# EasyEDA Pro project STM32_SG90稳定平台.eprj

# Schematic STM32_SG90稳定平台

## Sheets
1 STM32F103C8T6: Create Date: 2023-10-22; Page Name: STM32F103C8T6; Project Name: STM32_SG90稳定平台; Schematic Name: 原理图; Update Date: 2023-10-22; Add into BOM: yes; Company: 嘉立创EDA; Convert to PCB: yes; Page Size: A4; Version: V1.0
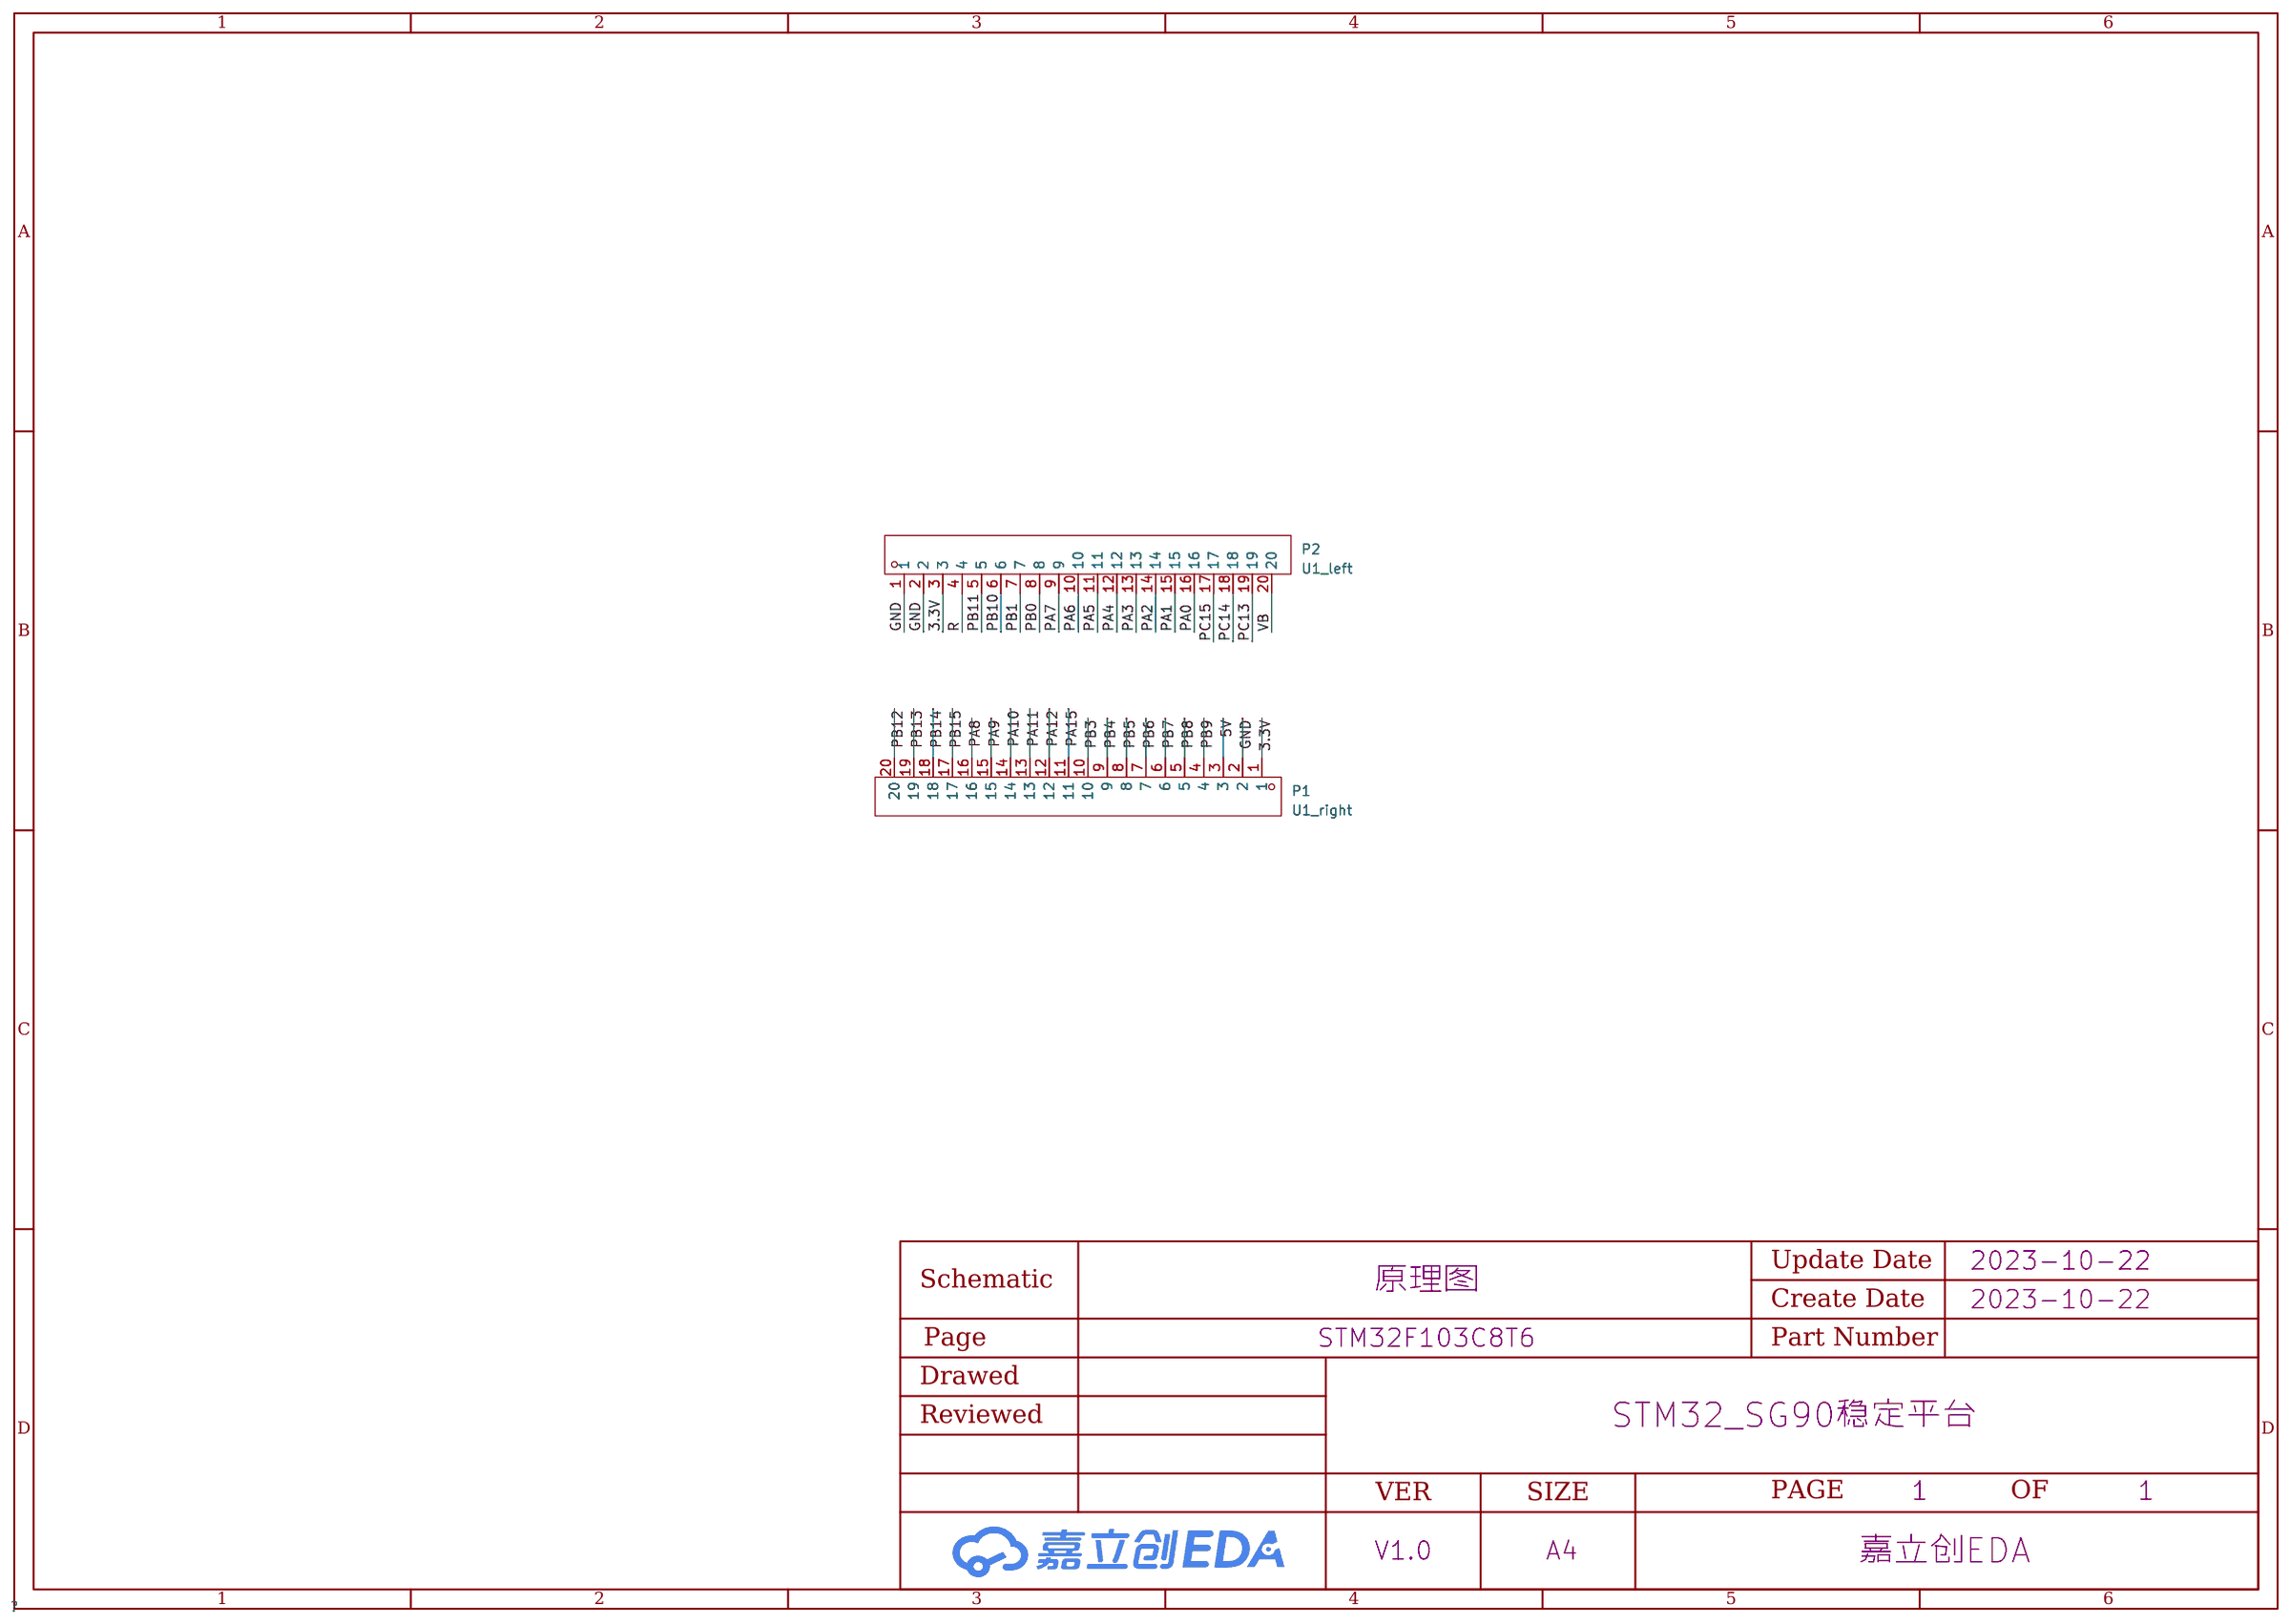
[diagram p0: STM32F103C8T6]
2 MPU6050: Page Name: MPU6050; Schematic Name: STM32_SG90稳定平台
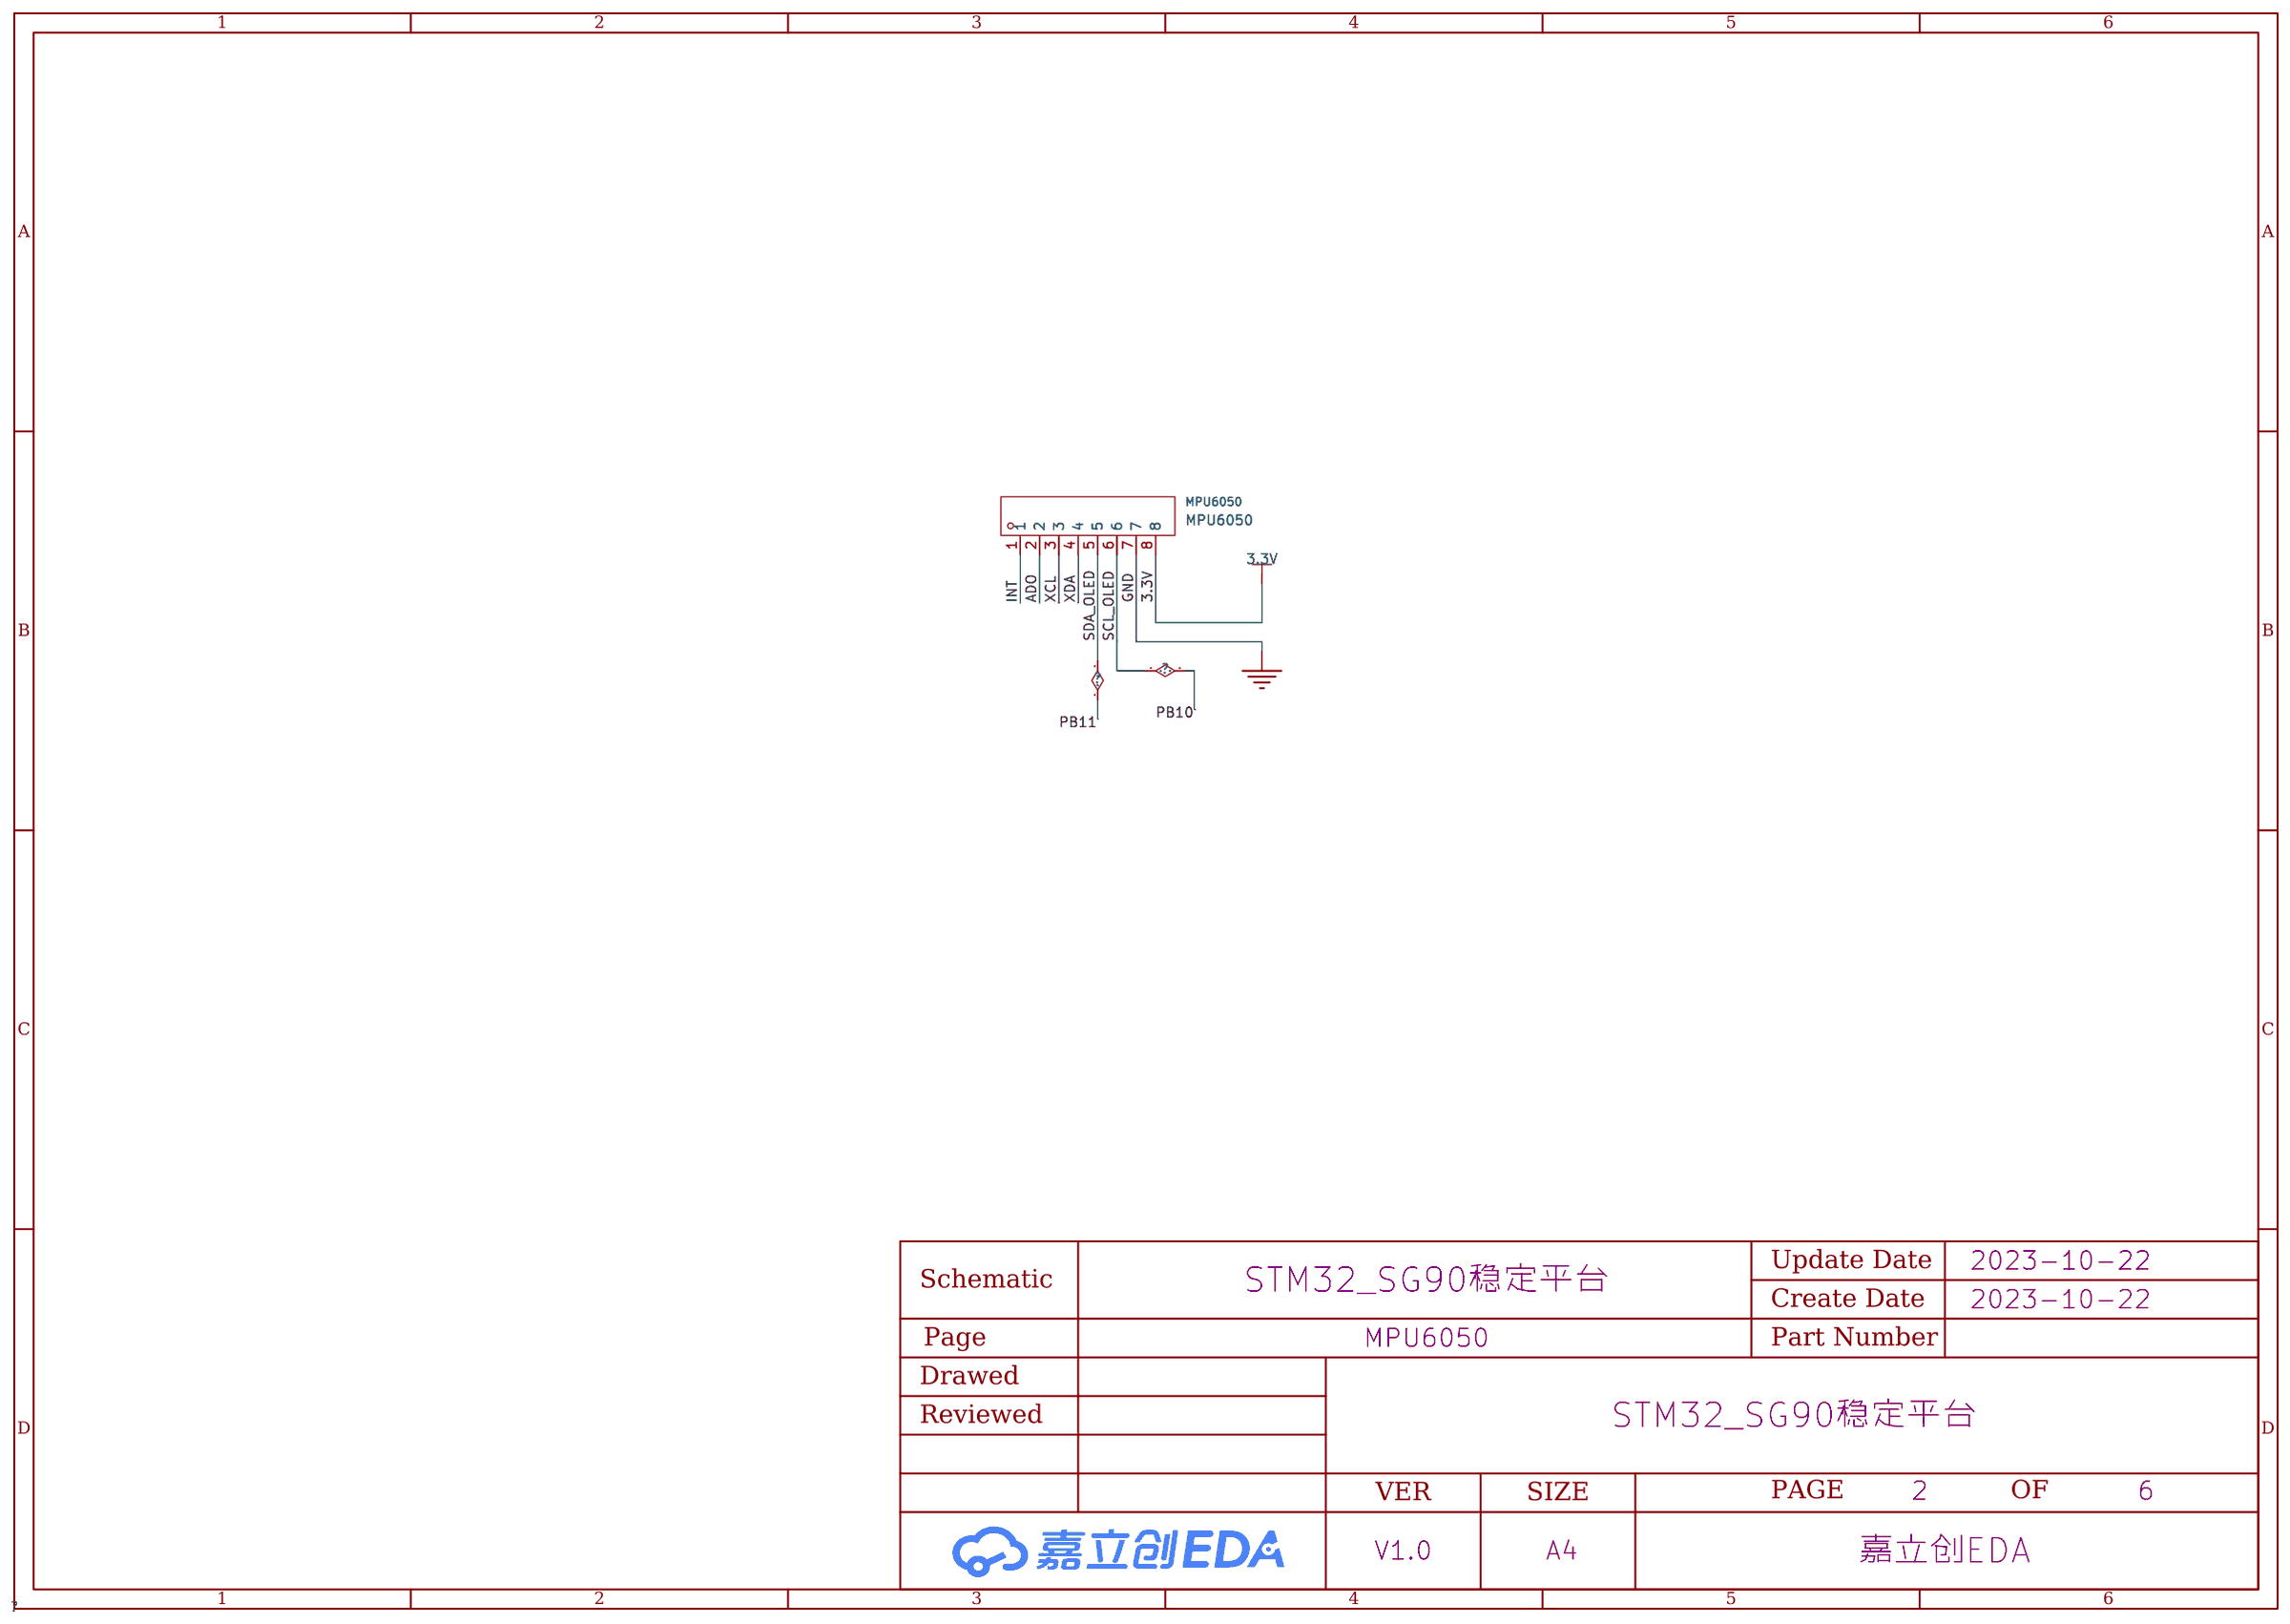
[diagram p1: MPU6050]
3 电源: Page Name: 电源; Schematic Name: STM32_SG90稳定平台
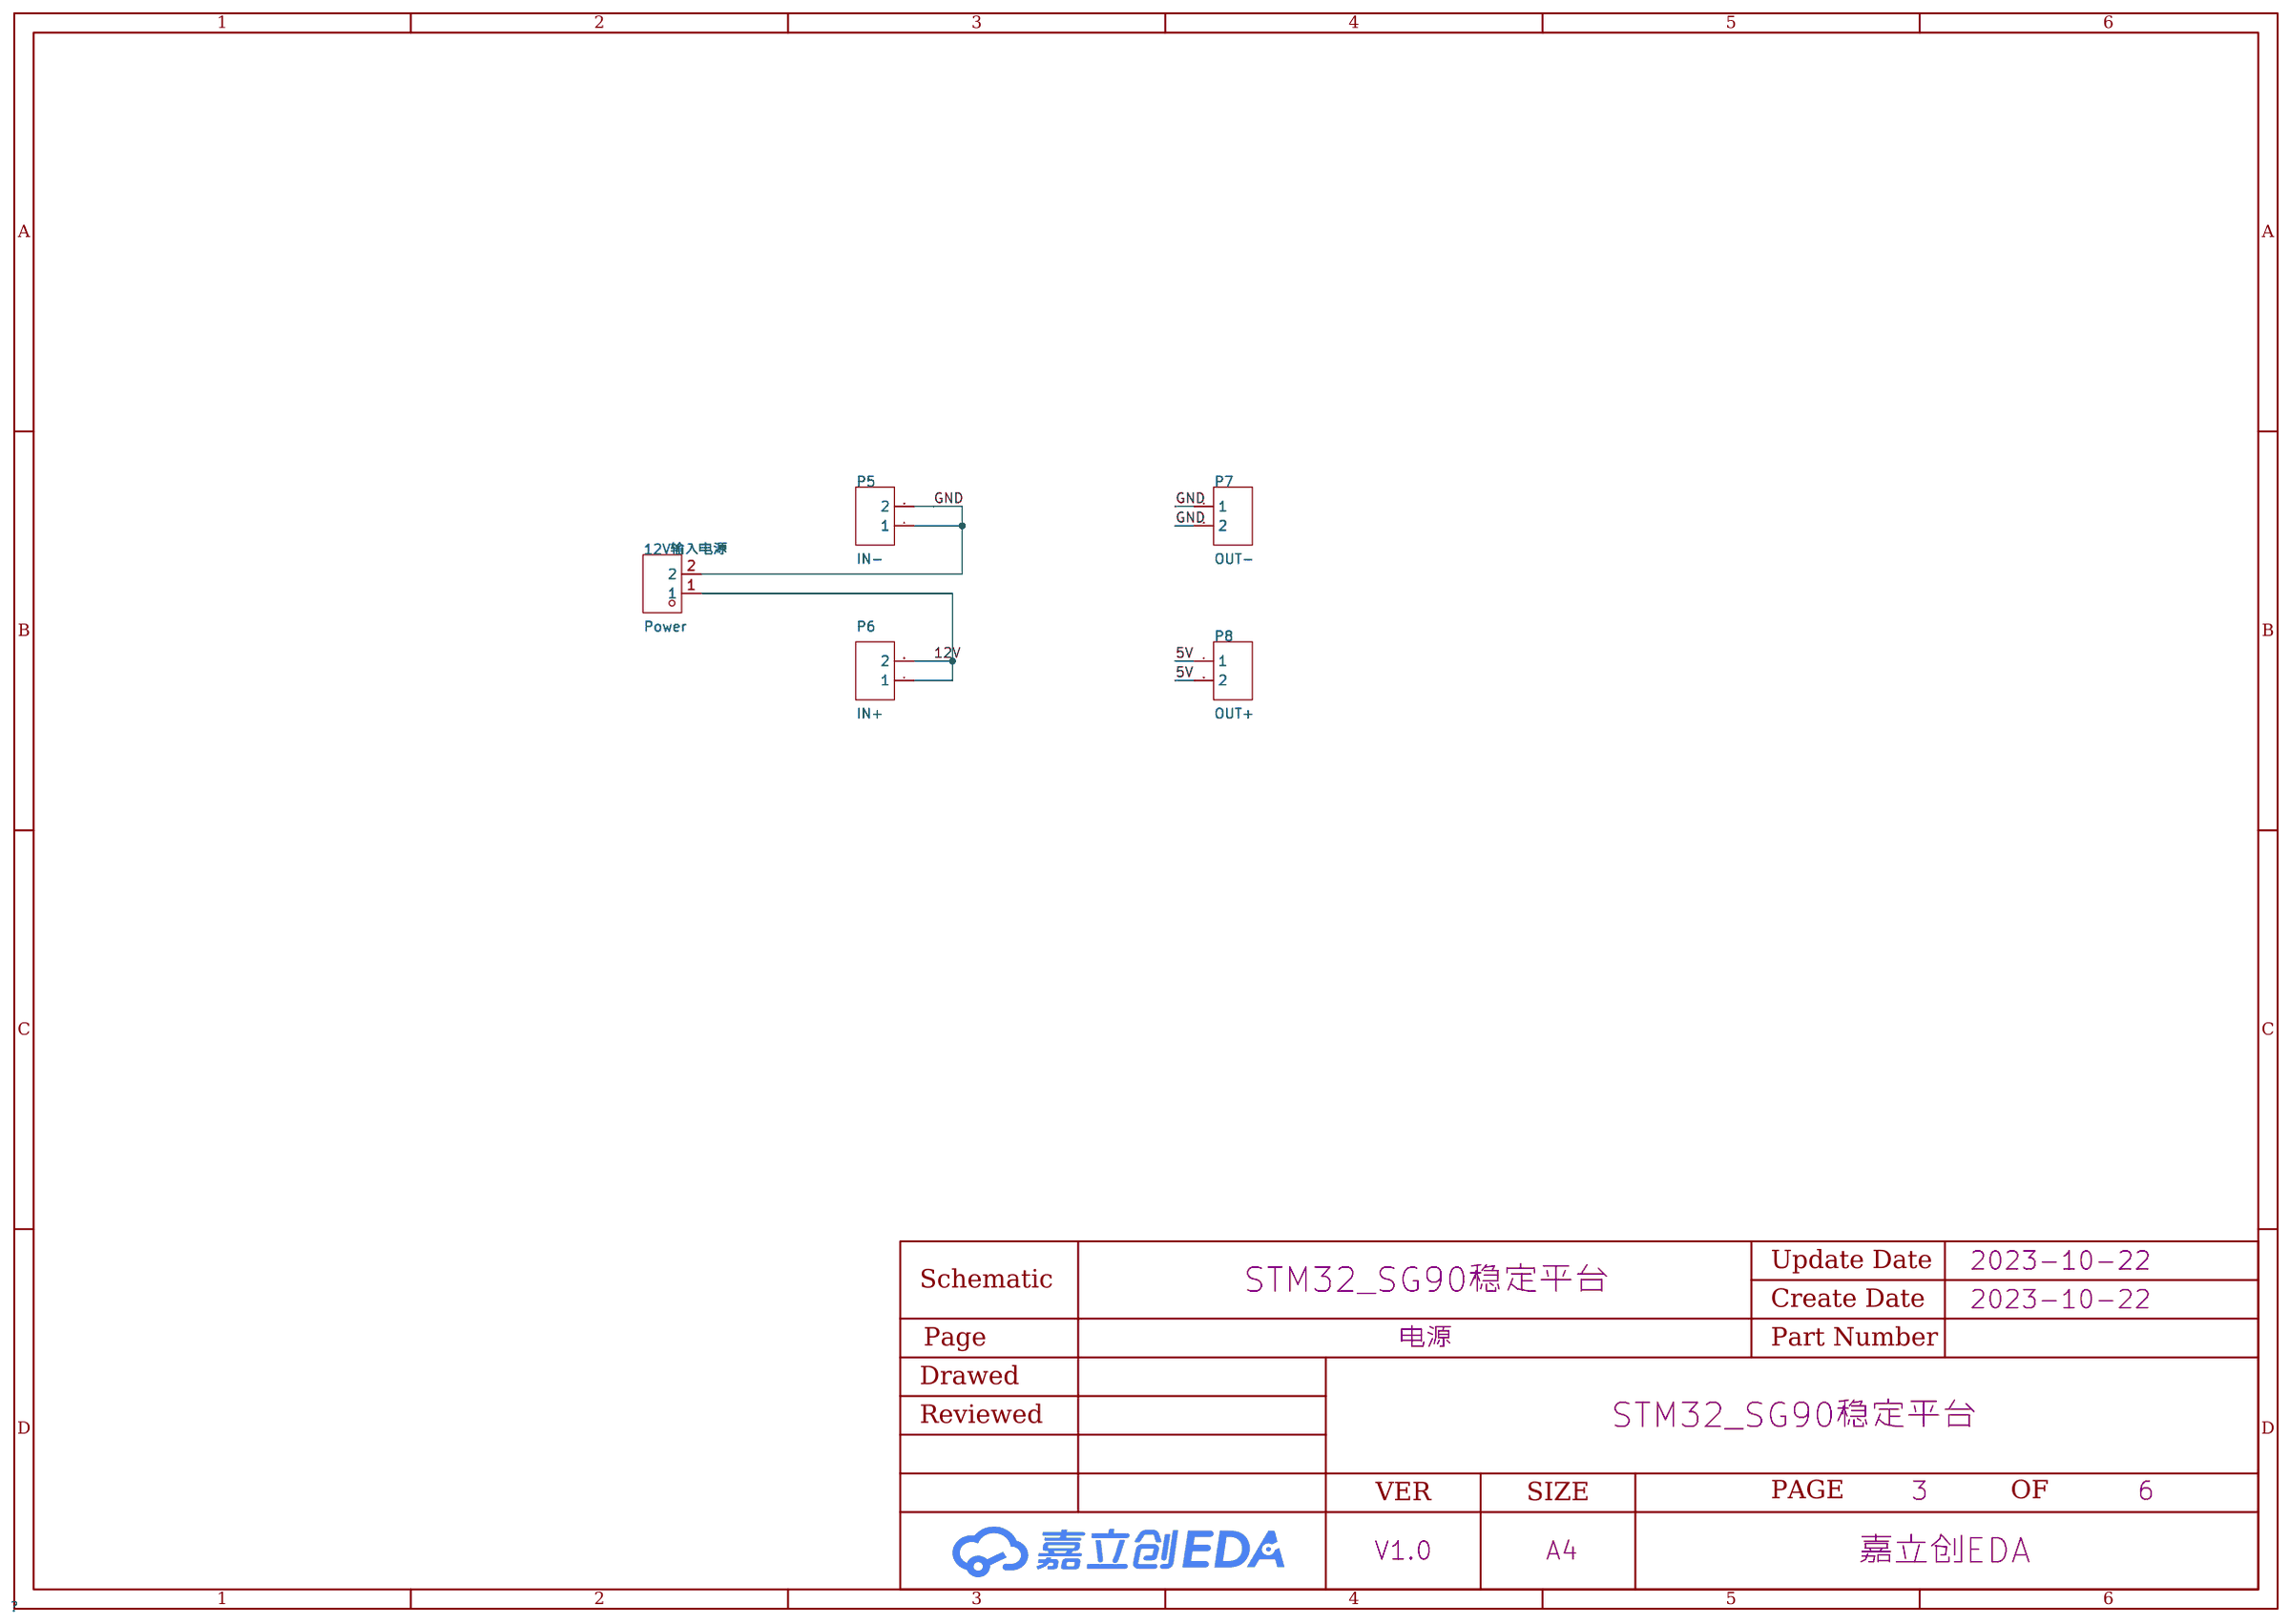
[diagram p2: 电源]
4 OLED: Page Name: OLED; Schematic Name: STM32_SG90稳定平台; Update Date: 2023-10-23
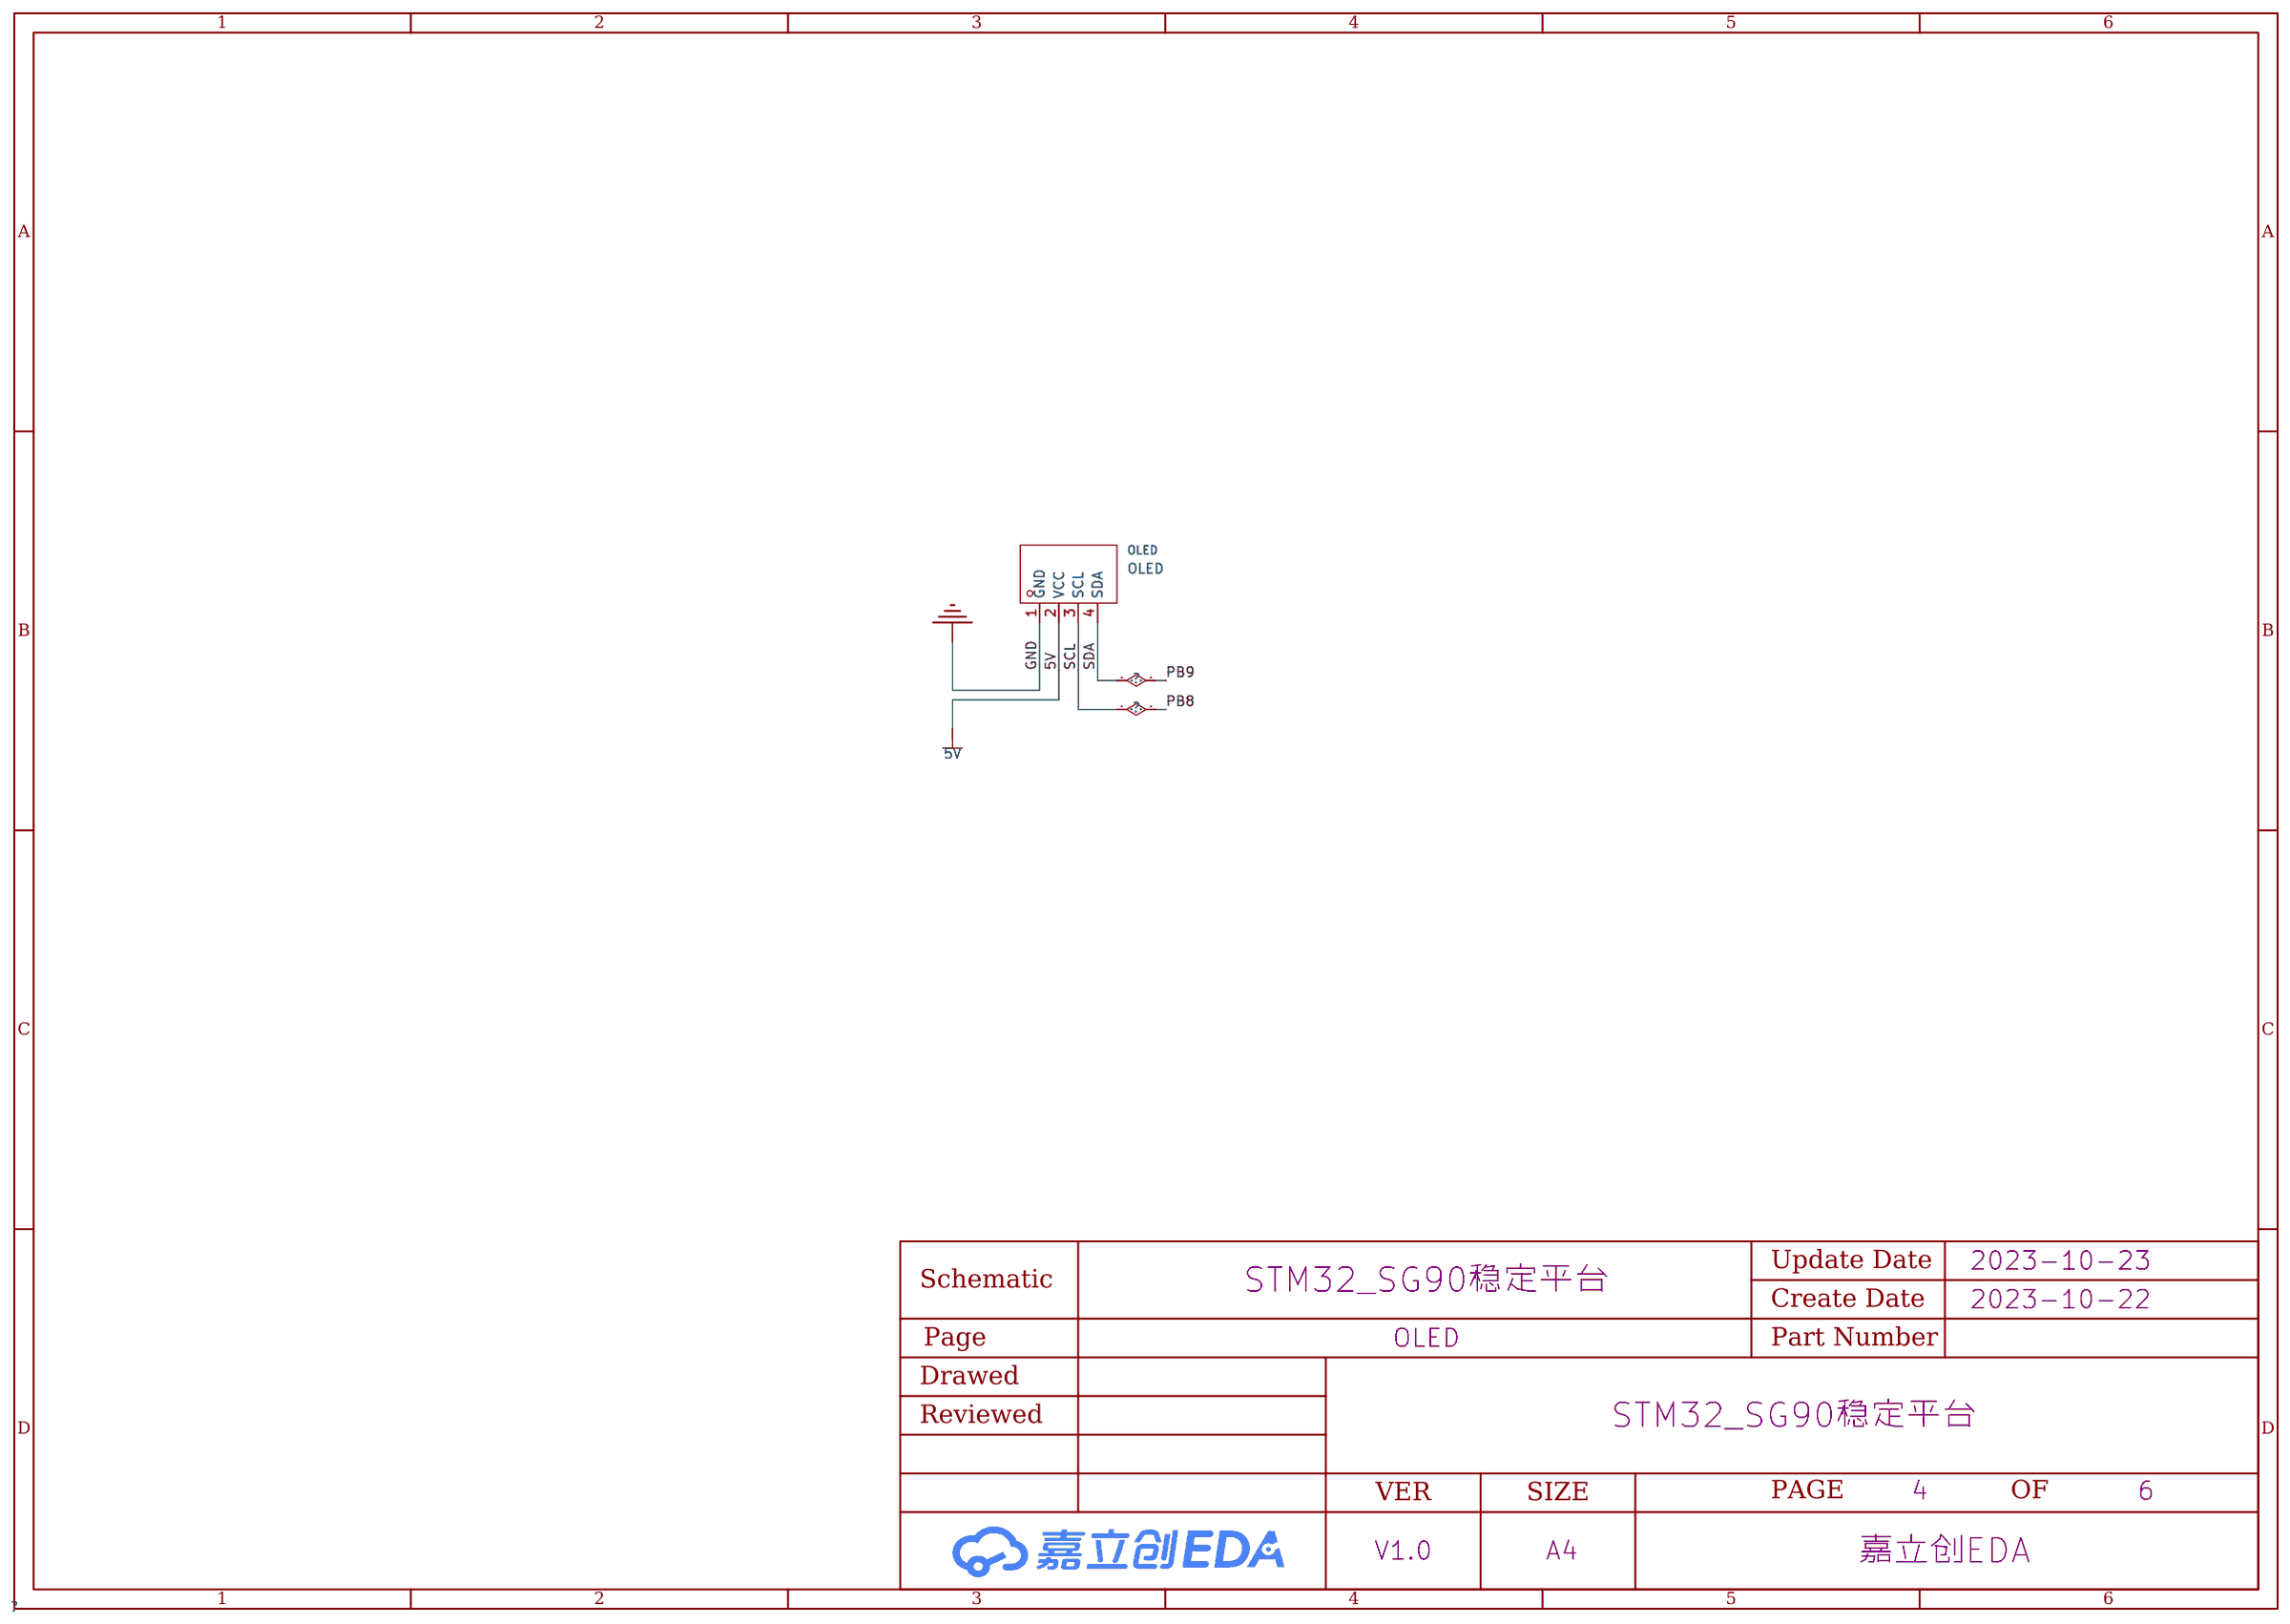
[diagram p3: OLED]
5 SG90舵机: Create Date: 2023-10-23; Page Name: SG90舵机; Schematic Name: STM32_SG90稳定平台; Update Date: 2023-10-23
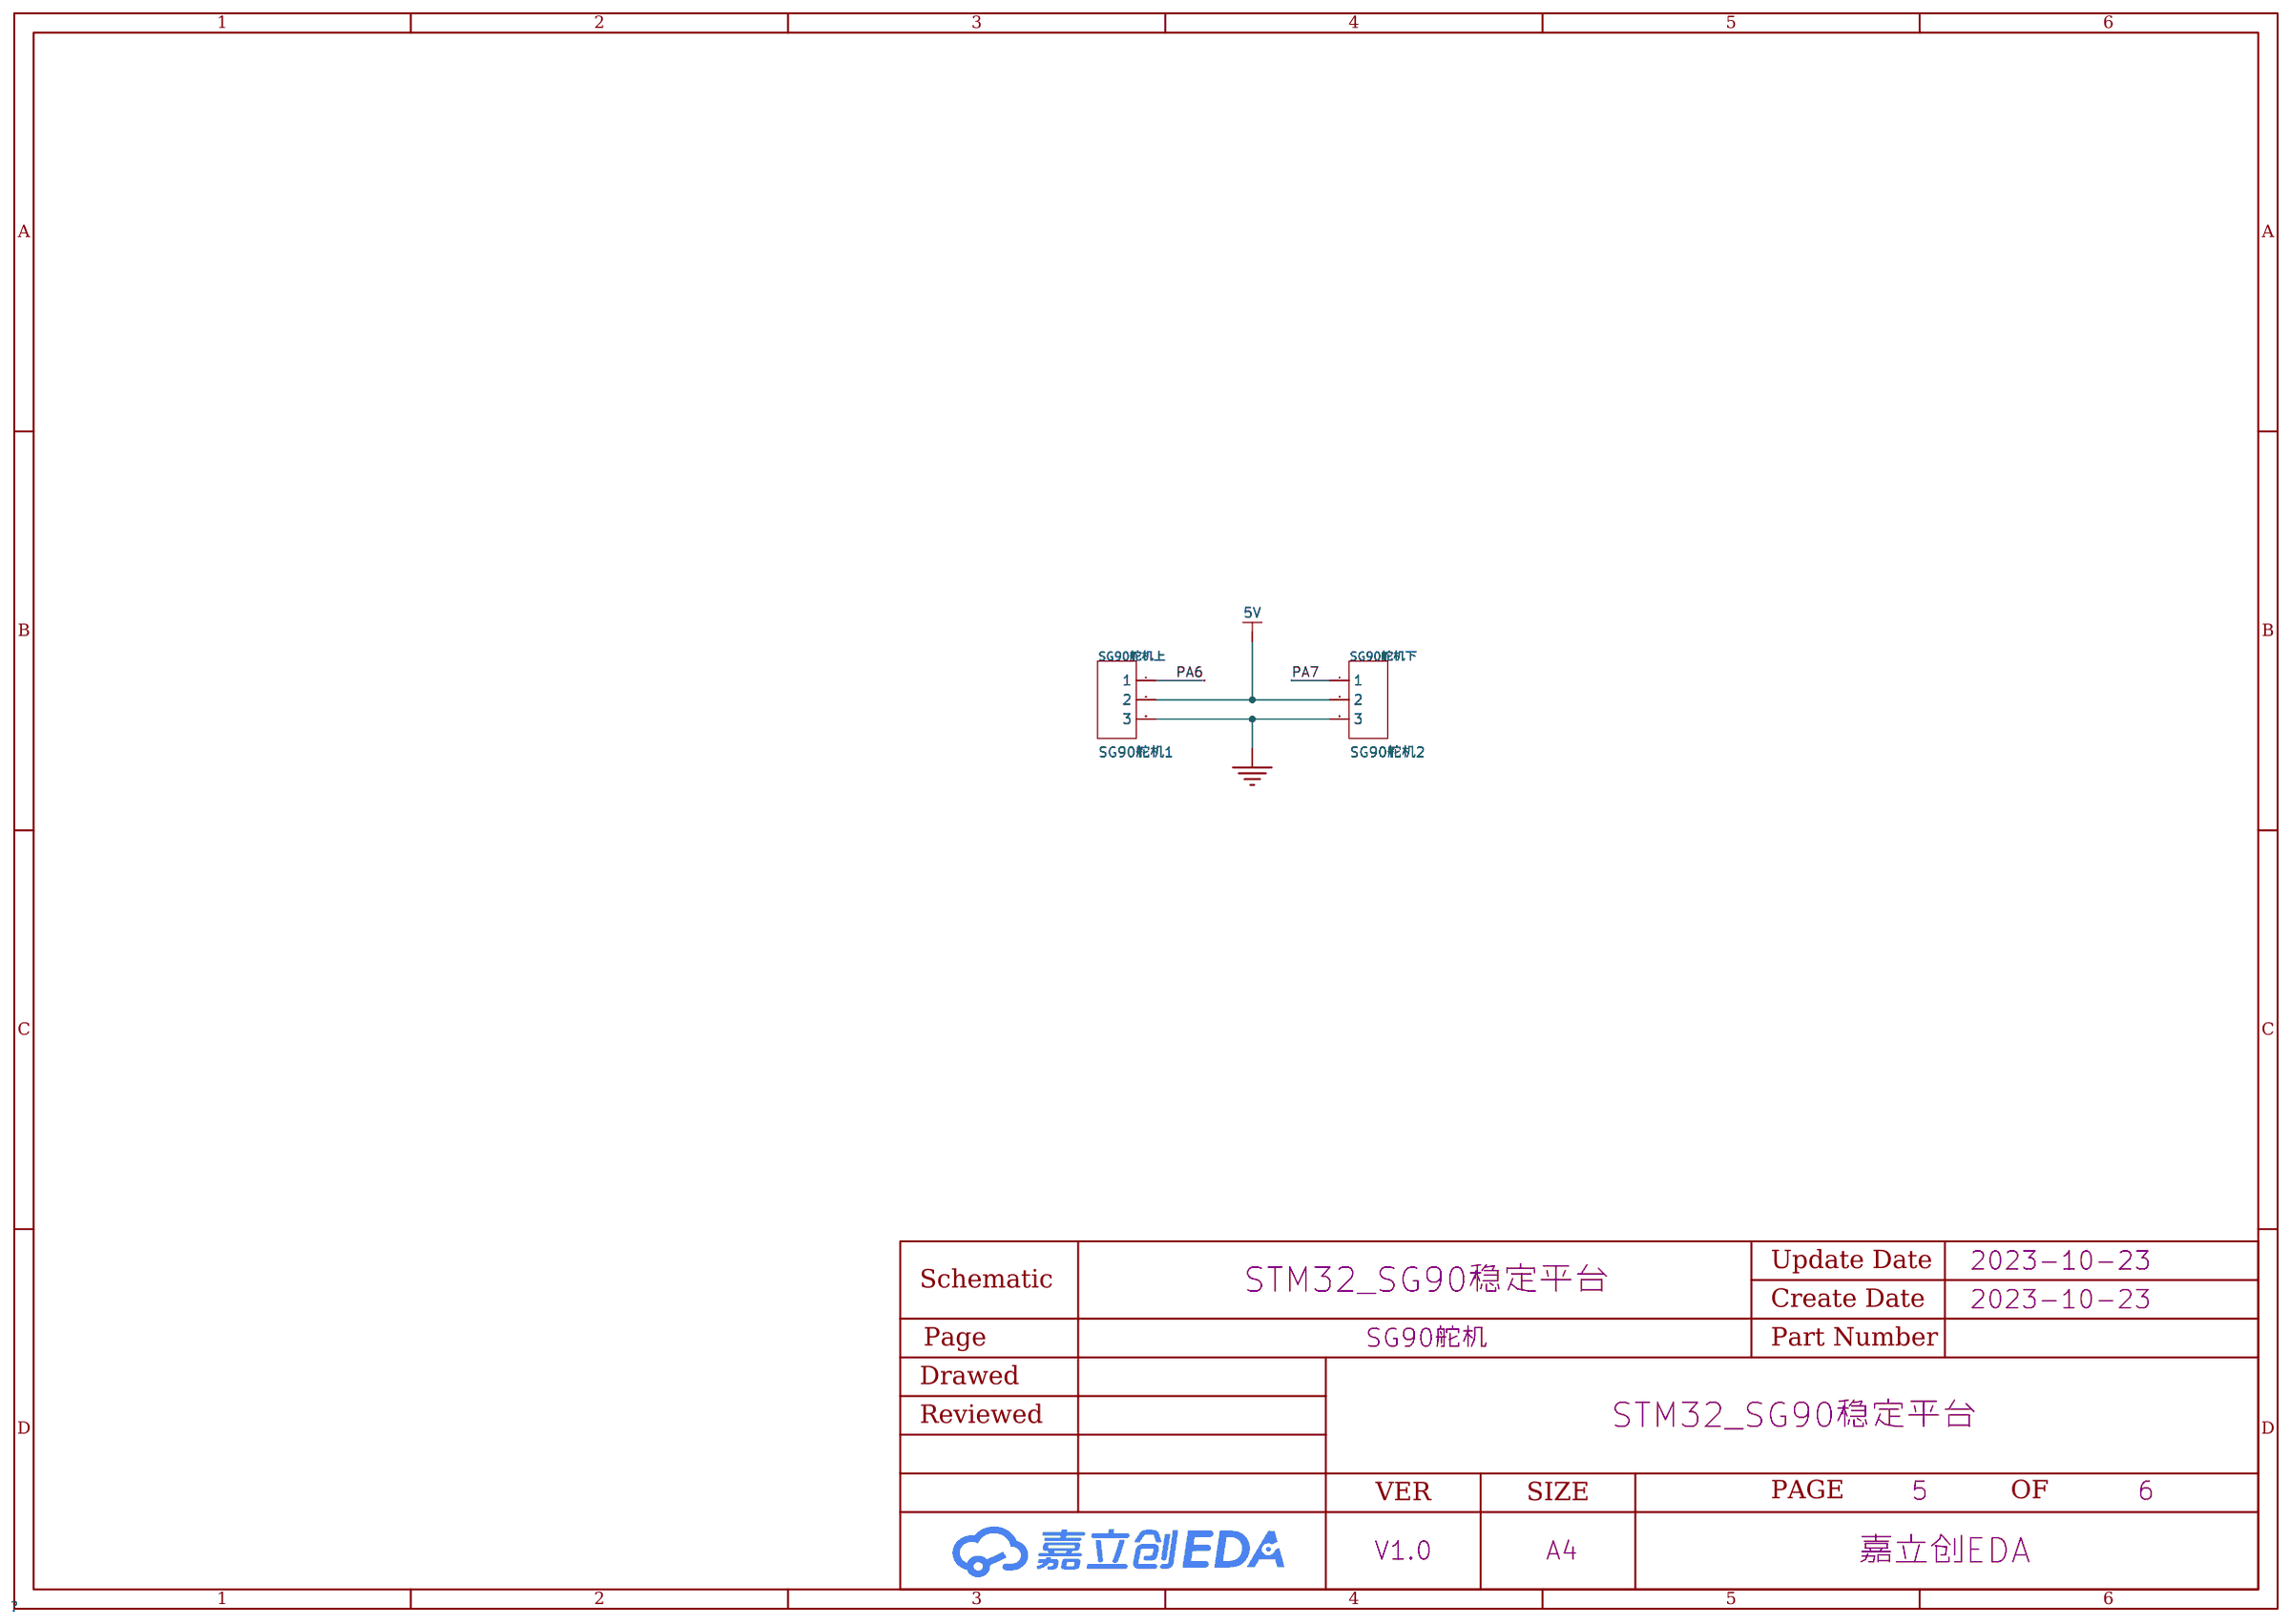
[diagram p4: SG90舵机]
6 串口: Create Date: 2023-10-23; Page Name: 串口; Schematic Name: STM32_SG90稳定平台; Update Date: 2023-10-23
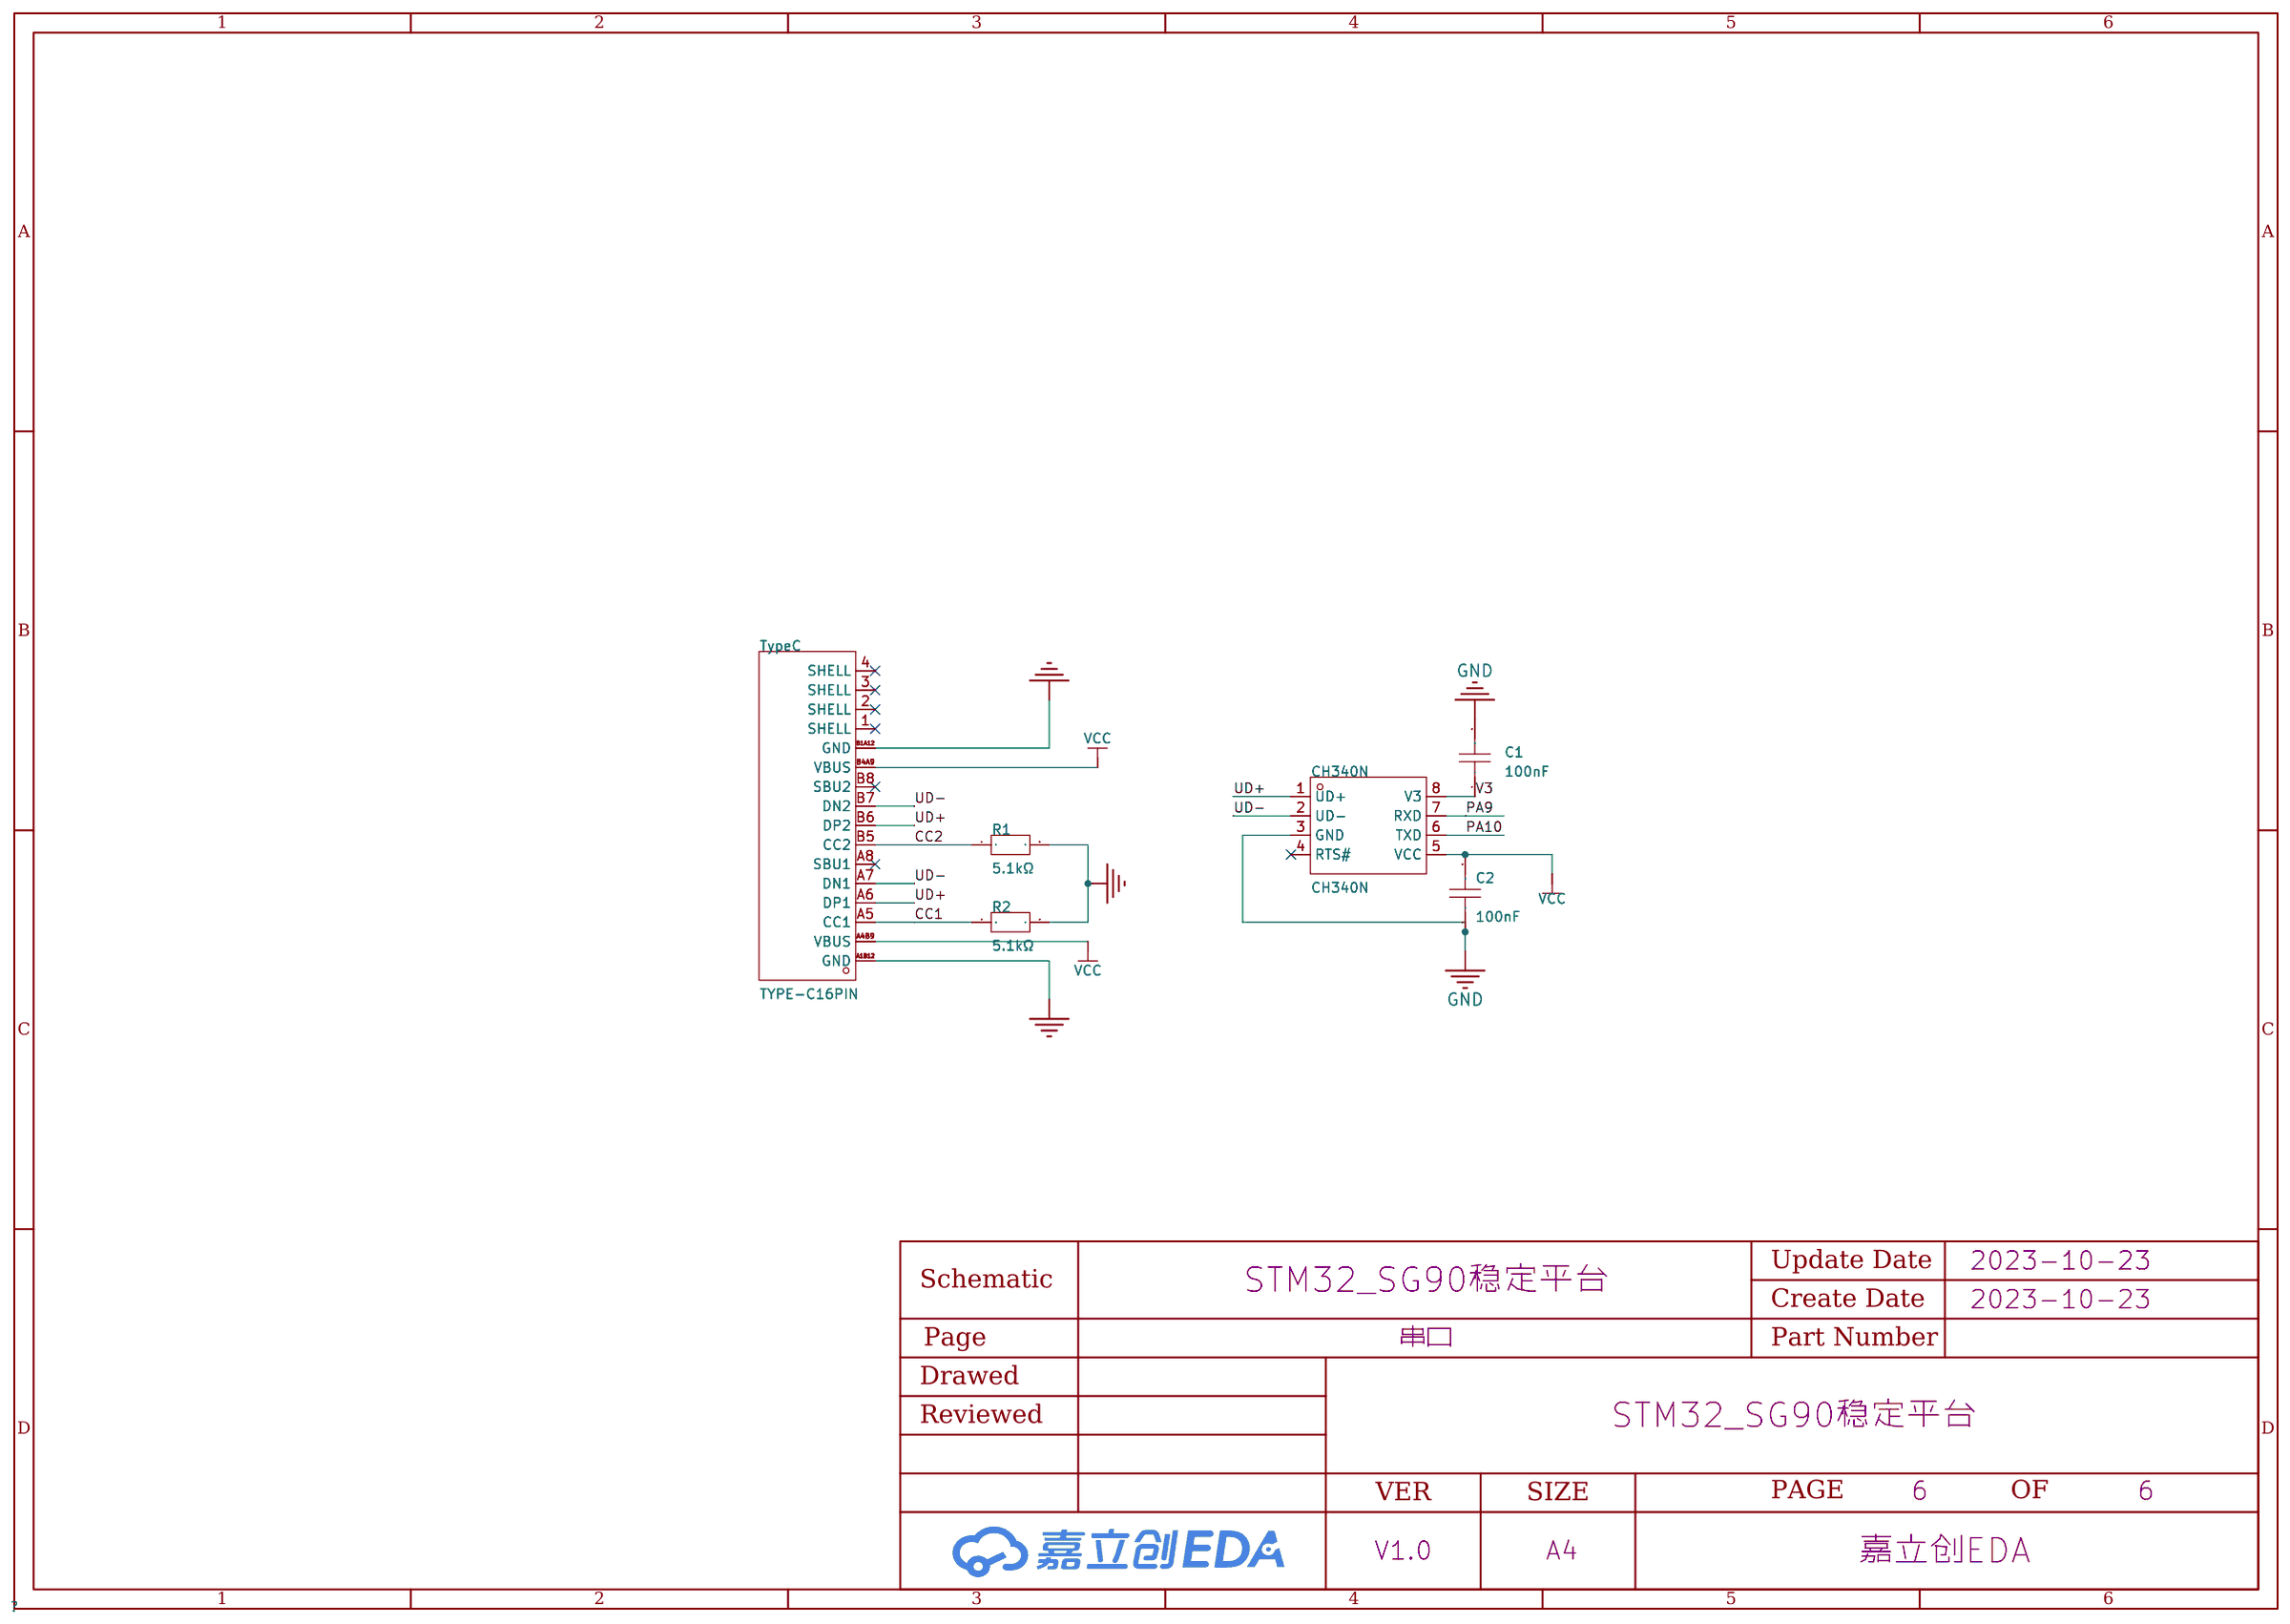
[diagram p5: 串口]

## Parts
sheet MPU6050
MPU6050  MPU6050  [HDR-TH_8P-P2.54-V-F]
sheet OLED
OLED  OLED  [OLED-TH_L27.8-W27.2-P2.54_C9900033791]
sheet SG90舵机
SG90舵机上  SG90舵机1  [HDR-TH_3P-P2.54-V-M-1]
SG90舵机下  SG90舵机2  [HDR-TH_3P-P2.54-V-M-1]
sheet STM32F103C8T6
P1  U1_right  [HDR-TH_20P-P2.54-V-F]
P2  U1_left  [HDR-TH_20P-P2.54-V-F]
sheet 串口
C1  100nF  [CAP-TH_L8.5-W5.0-P5.00-D1.2]
C2  100nF  [CAP-TH_L8.5-W5.0-P5.00-D1.2]
CH340N  CH340N  [SOP-8_L4.9-W3.9-P1.27-LS6.0-BL]
R1  5.1kΩ  [RES-TH_BD2.7-L6.2-P10.20-D0.4]
R2  5.1kΩ  [RES-TH_BD2.7-L6.2-P10.20-D0.4]
TypeC  TYPE-C16PIN  [USB-C-SMD_TYPE-C16PIN]
sheet 电源
12V输入电源  Power  [CONN-TH_KF7.62-2P]
P5  IN-  [HDR-TH_2P-P2.54-V-F]
P6  IN+  [HDR-TH_2P-P2.54-V-F]
P7  OUT-  [HDR-TH_2P-P2.54-V-F]
P8  OUT+  [HDR-TH_2P-P2.54-V-F]

## Library data of the parts
MPU6050 = ZX-PM2.54-1-8PY: 排数:单排;总孔位数:8P;间距:2.54mm;插孔结构:1x8P;行距:-;安装类型:直插;圆孔/方孔:方孔;额定电流:3A;额定电压:1kV;插孔方向:顶部;塑高:8.5mm;触头材质:青铜;触头镀层:金;工作温度范围:-40℃~+105℃;焊接温度(最大值):260℃@5S;; LCSC Part Name: 间距:2.54mm 1x8P 直插; Supplier Part: C7499328; Manufacturer: Megastar(兆星); Supplier Footprint: 插件,P=2.54mm; Datasheet: https://atta.szlcsc.com/upload/public/pdf/source/20230804/D626B3CF681C0E68EA183C516E9CB982.pdf; Supplier: LCSC; Number of Rows: 单排; Number of Holes: 8P; Pitch: 2.54mm; Holes Structure: 1x8P; Mounting Type: 直插; Circular Hole / Square Hole: 方孔; Current Rating (Max): 3A; Voltage Rating (Max): 1kV; Holes Direction: 顶部; Insulation Height: 8.5mm; Contact Material: 青铜; Contact Plating: 金; Operating Temperature Range: -40℃~+105℃; Welding Temperature (Max): 260℃@5S
OLED = HS96L03W2C03: 尺寸(inch)：0.96寸 0.96' 像素分辨率：128x64 128*64主控芯片：SSD1315 接口类型：I2C 外形:27.3*27.8；IIC/3SPI/4SPI串口通讯,工作温度范围-40℃—+70℃。4PIN黑底白光。; LCSC Part Name: 0.96寸OLED显示屏窄白光IIC; Supplier Part: C5248080; Manufacturer: HS(汉昇); JLCPCB Part Class: Extended Part; Datasheet: https://atta.szlcsc.com/upload/public/pdf/source/20230627/763D01F79A90007632F098068C7C8AD9.pdf; Supplier: LCSC
SG90舵机上 SG90舵机下 = 2.54-1*3P针: 排数:单排;总PIN位数:3;间距:2.54mm;插针结构:1x3P;行距:-;安装类型:直插;圆针/方针:方针;额定电流:3A;额定电压:-;配合针长度:-;塑高:-;端接针长度:-;触头材质:-;触头镀层:-;工作温度范围:-40℃~+105℃;颜色:黑色;; LCSC Part Name: 2.54mm 1x3P 直插 方针; Supplier Part: C49257; Manufacturer: BOOMELE(博穆精密); Supplier Footprint: 直插,P=2.54mm; JLCPCB Part Class: 扩展库; Supplier: LCSC; Number of Rows: 单排; Number of Pins: 3; Pitch: 2.54mm; Pin Structure: 1x3P; Mounting Type: 直插; Circluar Pins/Square Pins: 方针; Current Rating (Max): 3A; Operating Temperature Range: -40℃~+105℃; Color: 黑色
P1 P2 = 22850120ANG1SYA01: 排数:单排;总孔位数:20P;间距:2.54mm;插孔结构:1x20P;行距:-;安装类型:直插;塑高:-;触头材质:黄铜;触头镀层:-;; LCSC Part Name: 间距:2.54mm 1x20P 直插; Supplier Part: C429947; Manufacturer: JILN(锦凌); Supplier Footprint: 插件,P=2.54mm; JLCPCB Part Class: 扩展库; Datasheet: https://atta.szlcsc.com/upload/public/pdf/source/20190920/C429966_F6288D72CB1EF194DAF75E8AC5D57877.pdf; Supplier: LCSC; Number of Rows: 单排; Number of Holes: 20P; Pitch: 2.54mm; Holes Structure: 1x20P; Mounting Type: 直插; Contact Material: 黄铜
C1 C2 = CT4-0805B104K500F3: 容值:100nF;精度:±10%;额定电压:50V;温度系数:X7R;; LCSC Part Name: 100nF ±10% 50V; Supplier Part: C84772; Manufacturer: FH(风华); Supplier Footprint: 插件,P=5.08mm; JLCPCB Part Class: 扩展库; Datasheet: https://atta.szlcsc.com/upload/public/pdf/source/20161024/1477288669695.pdf; Supplier: LCSC; Tolerance: ±10%; Voltage Rated: 50V; Temperature Coefficient: X7R
CH340N = CH340N: Supplier Part: C2977777; Manufacturer: WCH(南京沁恒); Supplier Footprint: SOP-8; JLCPCB Part Class: Extended Part; Datasheet: https://atta.szlcsc.com/upload/public/pdf/source/20220223/82A45E4FF89B3EDCAD50B354450A7EF4.pdf; Supplier: LCSC
R1 R2 = CR1/4W-5K1±5%-ST26: 电阻类型:碳膜电阻;阻值:5.1kΩ;精度:±5%;功率:250mW;; LCSC Part Name: 碳膜电阻 5.1kΩ ±5% 250mW; Supplier Part: C2896864; Manufacturer: VO(翔胜); Supplier Footprint: 插件,2.7x6.2mm; JLCPCB Part Class: 扩展库; Datasheet: https://atta.szlcsc.com/upload/public/pdf/source/20210803/C2857407_45FF53FE186CAB545115AD37303966CD.pdf; Supplier: LCSC; Type: 碳膜电阻; Tolerance: ±5%; Power(Watts): 250mW; Temperature Coefficient: ±350ppm/℃; Overload Voltage (Max): 250V; Operating Temperature Range: -55℃~+155℃
TypeC = TYPE-C16PIN: 连接器类型:Type-C;标准:-;公母:母座;触点数量:16;端口数量:1;安装方式:卧贴;额定电流 - 电源:3A;工作温度范围:-40℃~+85℃;; LCSC Part Name: Type-C 母座 卧贴 快充闪充 停产; Supplier Part: C393939; Manufacturer: SHOU HAN(首韩); Supplier Footprint: SMD; JLCPCB Part Class: Extended Part; Datasheet: https://atta.szlcsc.com/upload/public/pdf/source/20190521/C393939_7B9043D4CF1026AF443AB60D91FBCD5C.pdf; Supplier: LCSC; Connector Type: Type-C; Gender: 母座; Number of Contacts: 16; Number of Ports: 1; Mounting Style: 卧贴; Current Rating - Power (Max): 3A; Operating Temperature Range: -40℃~+85℃
12V输入电源 = KF7.62-2P: 隔板类型:两面;间距:7.62mm;每排PIN数:2;排数:1;安装方式:直针;引脚位置:边脚;额定电流:24A;额定电压:450V;线规 - AWG:12~22;线规 - mm?:2.5;工作温度范围:-40℃~+105℃;颜色:黑色;; LCSC Part Name: 7.62mm 每排P数:2 排数:1 直针 边脚 黑色; Supplier Part: C707824; Manufacturer: KEFA(科发); Supplier Footprint: 直插,P=7.62mm; JLCPCB Part Class: 扩展库; Datasheet: https://atta.szlcsc.com/upload/public/pdf/source/20200911/C707824_085D20F539EB43FE255F4A82729CD447.pdf; Supplier: LCSC; Barrier Type: 两面; Pitch: 7.62mm; Number of PINs Per Row: 2; Number of Rows: 1; Mounting Style: 直针; Pin Location: 边脚; Current Rating (Max): 24A; Voltage Rating (Max): 450V; Wire Gauge - AWG: 12~22; Wire Gauge - mm?: 2.5; Operating Temperature Range: -40℃~+105℃; Color: 黑色
P5-P8 = 2.54-1*2P母: 排数:单排;总孔位数:2P;间距:2.54mm;插孔结构:1x2P;行距:-;安装类型:直插;塑高:-;触头材质:-;触头镀层:-;; LCSC Part Name: 间距:2.54mm 1x2P 直插; Supplier Part: C49661; Manufacturer: BOOMELE(博穆精密); Supplier Footprint: 插件,P=2.54mm; JLCPCB Part Class: 扩展库; Datasheet: https://atta.szlcsc.com/upload/public/pdf/source/20210301/C2718488_F4427B881E42CAA8DDB0B1C12B3A522C.pdf; Supplier: LCSC; Number of Rows: 单排; Number of Holes: 2P; Pitch: 2.54mm; Holes Structure: 1x2P; Mounting Type: 直插

## Nets
3.3V: MPU6050.8 P1.1 P2.3
5V: OLED.2(VCC) P1.3 P8.1 P8.2 SG90舵机上.2 SG90舵机下.2
12V: 12V输入电源.1 P6.1 P6.2
GND: 12V输入电源.2 C1.2 C2.1 CH340N.3(GND) MPU6050.7 OLED.1(GND) P1.2 P2.1 P2.2 P5.1 P5.2 P7.1 P7.2 R1.2 R2.2 SG90舵机上.3 SG90舵机下.3 TypeC.A1B12(GND) TypeC.B1A12(GND)
V3: C1.1 CH340N.8(V3)
VCC: C2.2 CH340N.5(VCC) TypeC.A4B9(VBUS) TypeC.B4A9(VBUS)
ADO: MPU6050.2
CC1: R2.1 TypeC.A5(CC1)
CC2: R1.1 TypeC.B5(CC2)
INT: MPU6050.1
PA0: P2.16
PA1: P2.15
PA2: P2.14
PA3: P2.13
PA4: P2.12
PA5: P2.11
PA6: P2.10 SG90舵机上.1
PA7: P2.9 SG90舵机下.1
PA8: P1.16
PA9: CH340N.7(RXD) P1.15
PA10: CH340N.6(TXD) P1.14
PA11: P1.13
PA12: P1.12
PA15: P1.11
PB0: P2.8
PB1: P2.7
PB3: P1.10
PB4: P1.9
PB5: P1.8
PB6: P1.7
PB7: P1.6
PB8: OLED.3(SCL) P1.5
PB9: OLED.4(SDA) P1.4
PB10: MPU6050.6 P2.6
PB11: MPU6050.5 P2.5
PB12: P1.20
PB13: P1.19
PB14: P1.18
PB15: P1.17
PC13: P2.19
PC14: P2.18
PC15: P2.17
R: P2.4
UD+: CH340N.1(UD+) TypeC.A6(DP1) TypeC.B6(DP2)
UD-: CH340N.2(UD-) TypeC.A7(DN1) TypeC.B7(DN2)
VB: P2.20
XCL: MPU6050.3
XDA: MPU6050.4

Not connected (* = marked no-connect by the designer): CH340N 4(RTS#)*; TypeC 1(SHELL)* 2(SHELL)* 3(SHELL)* 4(SHELL)* A8(SBU1)* B8(SBU2)*

# Board PCB1
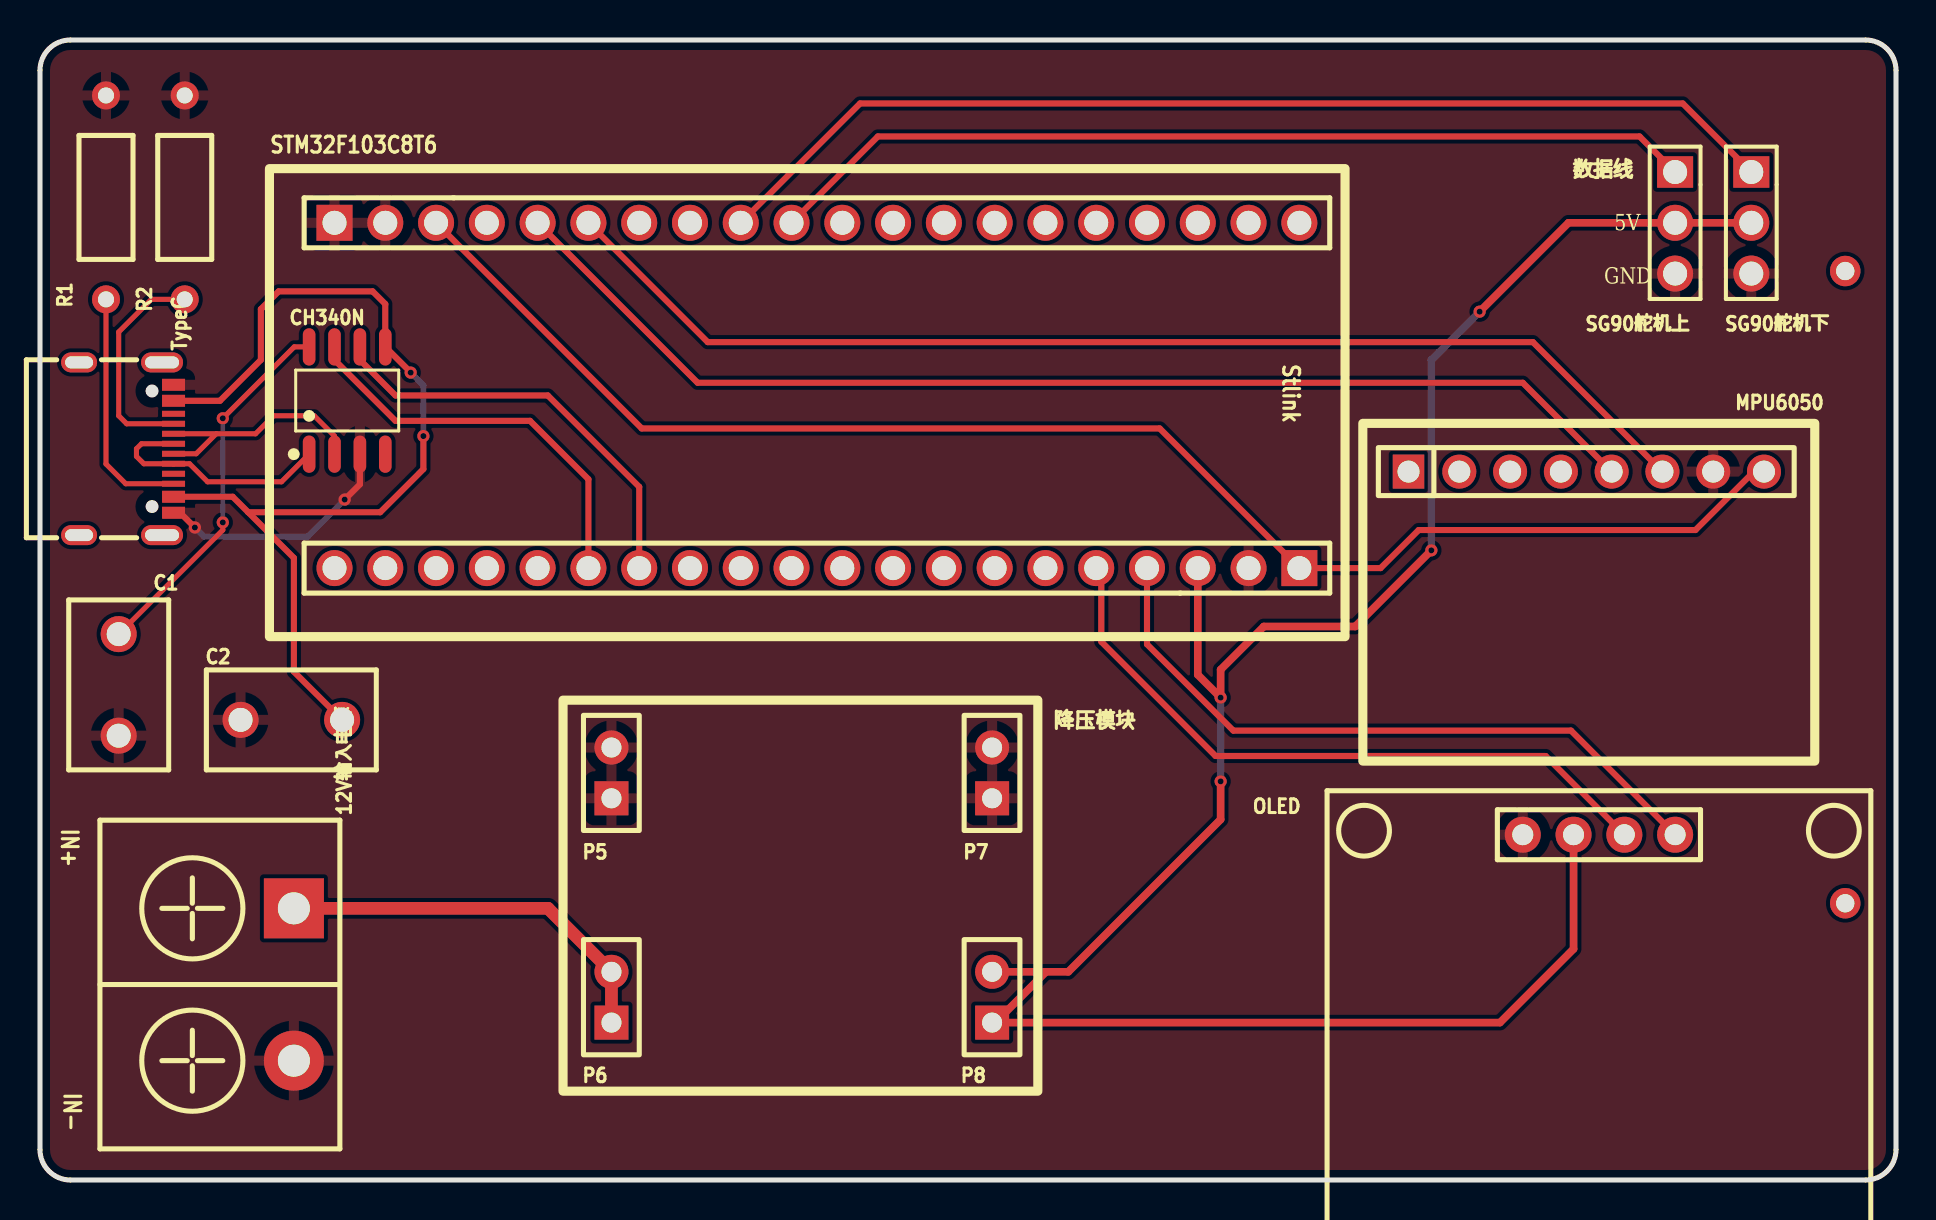
[diagram p6: board, top side]
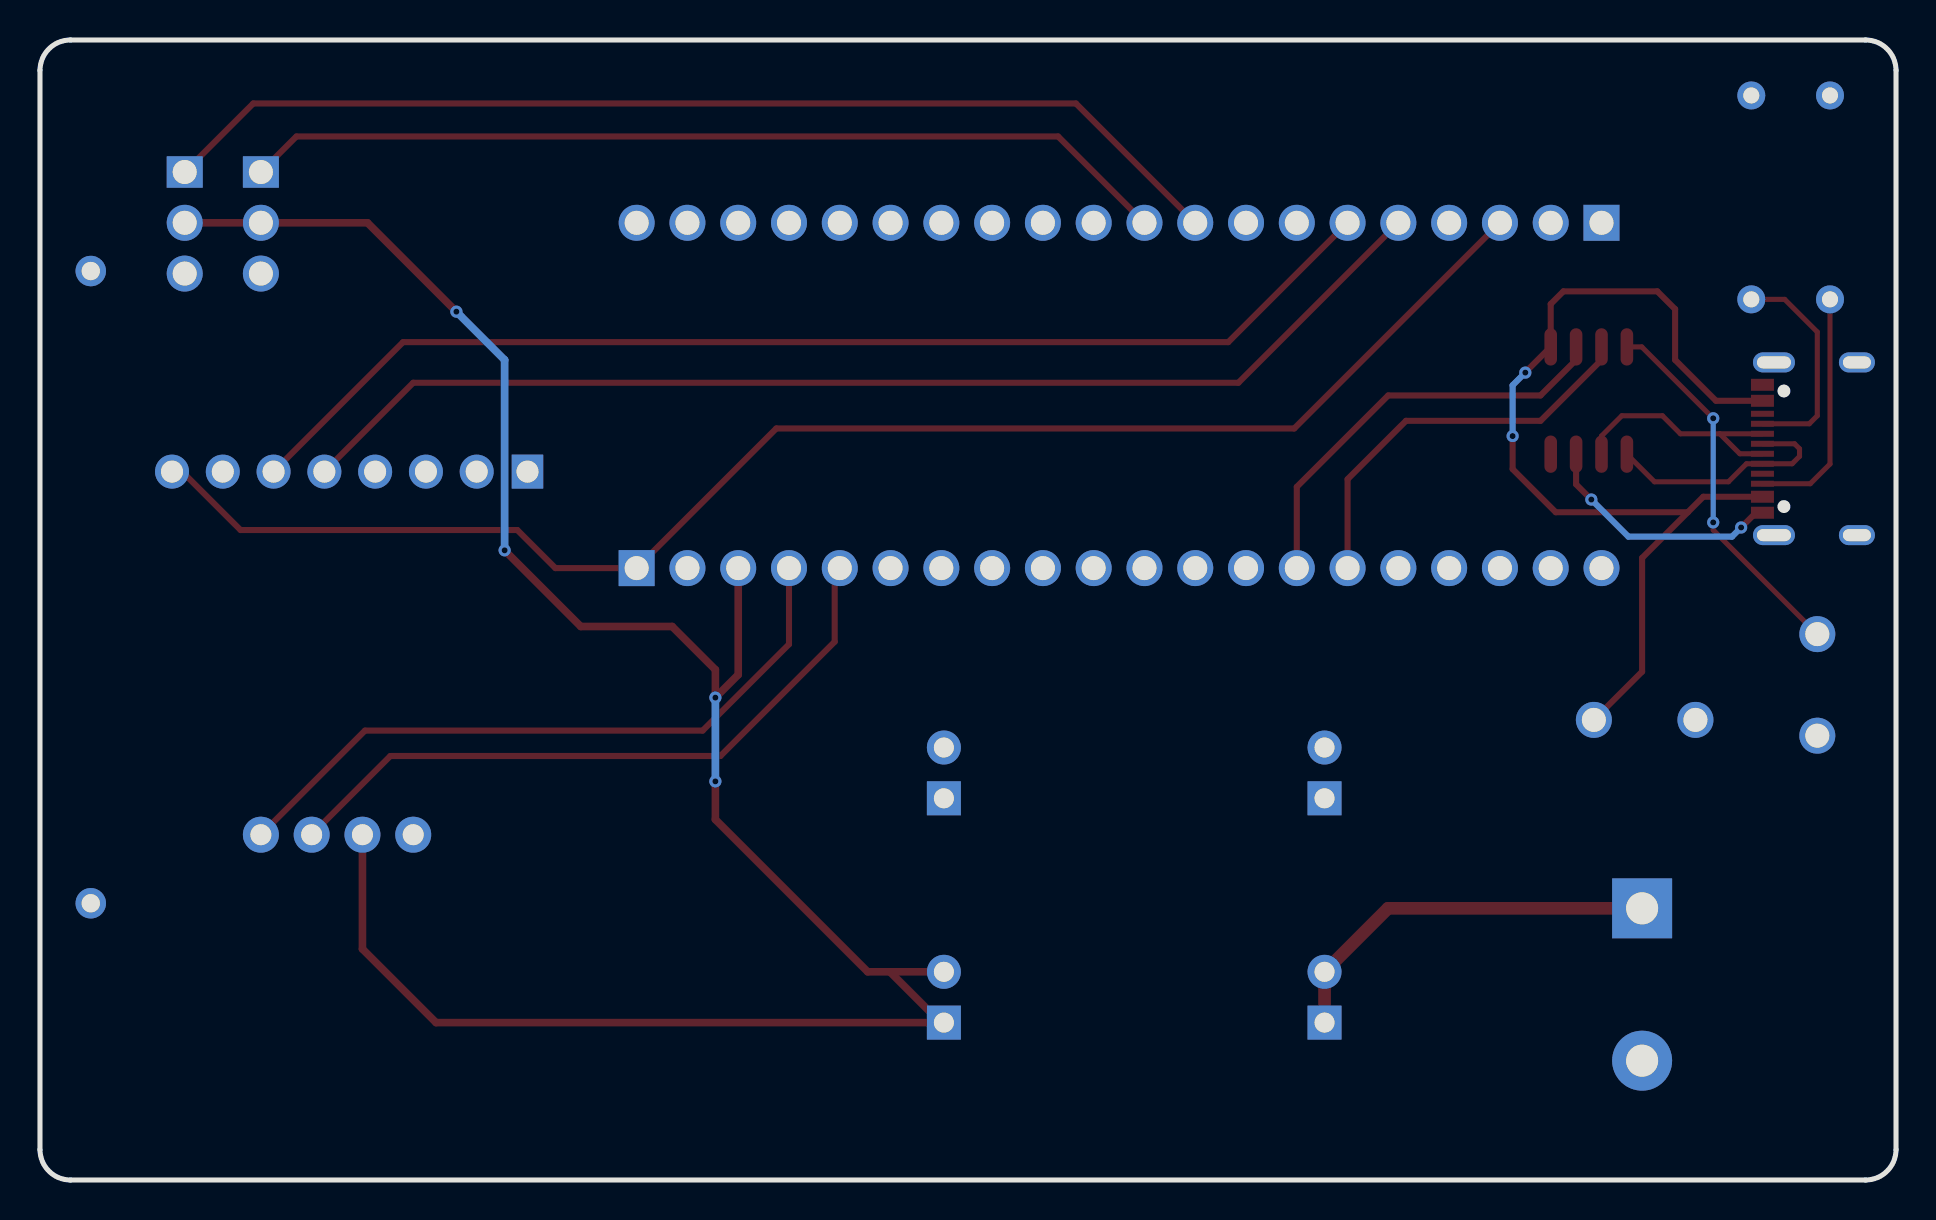
[diagram p7: board, bottom side, seen from below]

Outline 92.84 x 57.02 mm; copper layers: Top Layer, Bottom Layer. Coordinates in mm from the lower left corner of the outline.
Outline path: 0,55.5 0,1.52 arc(0.45,0.45) 1.52,0 91.31,0 arc(92.39,0.45) 92.84,1.52 92.84,55.5 arc(92.39,56.58) 91.31,57.02 1.52,57.02 arc(0.45,56.58) 0,55.5
Stack: Top Layer 0.035mm / Dielectric1 1.51mm FR4 er 4.5 / Bottom Layer 0.035mm

## Design rules (mm)
template: JLCPCB Capability(Two Layers Board)
spacing copperThickness1oz (default): track to track 0.102, other pairs 0.152 to 0.3
spacing copperThickness2oz: track to track 0.203, other pairs 0.152 to 0.3
track width copperThickness1oz (default): min 0.127, default 0.254, max 2.54
track width copperThickness2oz: min 0.203, default 0.254, max 2.54
differential pair differentialPair (default): width min 0.127, default 0.254, max 2.54; gap min 0.152, default 0.152
via viaSize (default): diameter min 0.5, default 0.61, max 10; hole min 0.3, default 0.305, max 6.3

## Placement (name value [footprint] x y rotation side)
12V输入电源  Power  [CONN-TH_KF7.62-2P]  12.7 9.78 270 top
C1  100nF  [CAP-TH_L8.5-W5.0-P5.00-D1.2]  3.94 24.77 270 top
C2  100nF  [CAP-TH_L8.5-W5.0-P5.00-D1.2]  12.57 23.02 0 top
CH340N  CH340N  [SOP-8_L4.9-W3.9-P1.27-LS6.0-BL]  15.37 38.99 0 top
MPU6050  MPU6050  [HDR-TH_8P-P2.54-V-F]  77.34 35.43 0 top
NOREF  -  [Pad_e232]  90.3 13.84 0 top
NOREF#2  -  [Pad_e231]  90.3 45.47 0 top
OLED  OLED  [OLED-TH_L27.8-W27.2-P2.54_C9900033791]  77.98 17.27 0 top
P1  U1_right  [HDR-TH_20P-P2.54-V-F]  38.86 30.61 180 top
P2  U1_left  [HDR-TH_20P-P2.54-V-F]  38.86 47.88 0 top
P5  IN-  [HDR-TH_2P-P2.54-V-F]  28.58 20.36 90 top
P6  IN+  [HDR-TH_2P-P2.54-V-F]  28.58 9.14 90 top
P7  OUT-  [HDR-TH_2P-P2.54-V-F]  47.62 20.36 90 top
P8  OUT+  [HDR-TH_2P-P2.54-V-F]  47.62 9.14 90 top
R1  5.1kΩ  [RES-TH_BD2.7-L6.2-P10.20-D0.4]  3.3 49.15 90 top
R2  5.1kΩ  [RES-TH_BD2.7-L6.2-P10.20-D0.4]  7.24 49.15 90 top
SG90舵机上  SG90舵机1  [HDR-TH_3P-P2.54-V-M-1]  81.79 47.88 270 top
SG90舵机下  SG90舵机2  [HDR-TH_3P-P2.54-V-M-1]  85.6 47.88 270 top
TypeC  TYPE-C16PIN  [USB-C-SMD_TYPE-C16PIN]  4.32 36.58 270 top

## Footprints (pads in the part's own frame, mm; a bottom-side part is the same pattern mirrored in y, then rotated)
CAP-TH_L8.5-W5.0-P5.00-D1.2
  round 1.8 hole 1.2: 1(-2.54,0) 2(2.54,0)
CONN-TH_KF7.62-2P
  rect 3x3 hole 1.6: 1(-3.81,0)
  round 3 hole 1.6: 2(3.81,0)
HDR-TH_2P-P2.54-V-F
  rect 1.7x1.7 hole 1: 1(-1.27,0)
  round 1.7 hole 1: 2(1.27,0)
HDR-TH_3P-P2.54-V-M-1
  rect 1.575x1.8 hole 1.2: 1(-2.54,0)
  round 1.8 hole 1.2: 2(0,0) 3(2.54,0)
HDR-TH_8P-P2.54-V-F
  rect 1.575x1.7 hole 1.1: 1(-8.89,0)
  round 1.7 hole 1.1: 2(-6.35,0) 3(-3.81,0) 4(-1.27,0) 5(1.27,0) 6(3.81,0) 7(6.35,0) 8(8.89,0)
HDR-TH_20P-P2.54-V-F
  rect 1.8x1.8 hole 1.2: 1(-24.13,0)
  round 1.8 hole 1.2: 2(-21.59,0) 3(-19.05,0) 4(-16.51,0) 5(-13.97,0) 6(-11.43,0) 7(-8.89,0) 8(-6.35,0) 9(-3.81,0) 10(-1.27,0) 11(1.27,0) 12(3.81,0) 13(6.35,0) 14(8.89,0) 15(11.43,0) 16(13.97,0) 17(16.51,0) 18(19.05,0) 19(21.59,0) 20(24.13,0)
OLED-TH_L27.8-W27.2-P2.54_C9900033791
  round 1.8 hole 1.05: 1(-3.81,0) 2(-1.27,0) 3(1.27,0) 4(3.81,0)
Pad_e231
  round 1.524 hole 0.914: 21(0,0)
Pad_e232
  round 1.524 hole 0.914: 22(0,0)
RES-TH_BD2.7-L6.2-P10.20-D0.4
  round 1.4 hole 0.8: 1(-5.1,0) 2(5.1,0)
SOP-8_L4.9-W3.9-P1.27-LS6.0-BL
  oval 0.63x1.865 smd: 1(-1.905,-2.683) 2(-0.635,-2.683) 3(0.635,-2.683) 4(1.905,-2.683) 5(1.905,2.683) 6(0.635,2.683) 7(-0.635,2.683) 8(-1.905,2.683)
USB-C-SMD_TYPE-C16PIN
  oval 1x2.1 hole 0.6x1.7: 1(-4.32,1.788) 2(4.32,1.788)
  oval 1x1.8 hole 0.6x1.4: 3(-4.32,-2.362) 4(4.32,-2.362)
  rect 0.6x1.15 smd: A1B12(-3.2,2.362) A4B9(-2.4,2.362) B1A12(3.2,2.362) B4A9(2.4,2.362)
  rect 0.3x1.15 smd: A5(-1.25,2.362) A6(-0.25,2.362) A7(0.25,2.362) A8(-1.75,2.362) B5(1.75,2.362) B6(0.75,2.362) B7(-0.75,2.362) B8(1.25,2.362)

## Nets
As in the schematic.

Pads without a net: CH340N 4; NOREF 22; NOREF#2 21; TypeC 1 2 3 4 A8 B8

## Via types
v1: diameter 0.61, hole 0.305, Top Layer to Bottom Layer, 10 vias

## Routing (per net, layer and track width the routed paths; a pad name or vN(x,y) marks a point on that pad's centre or on a via; arc(x,y) is an arc through that point)
3.3V: length 75.6
  Top Layer w0.305: 19.81,47.88 30.1,37.59 56.01,37.59 P1.1 67.06,30.61 68.96,32.51 82.8,32.51 85.73,35.43 MPU6050.8
5V: length 110.3
  Top Layer w0.381: v1(69.6,31.5) 65.79,27.69 61.21,27.69 59.05,25.53 v1(59.05,24.13) 57.91,25.27 57.91,30.61 ; P8.1 47.78,7.87 ; 47.78,7.87 50.32,10.41 ; 47.78,7.87 73.02,7.87 76.71,11.56 OLED.2 ; 50.32,10.41 P8.2 ; 50.32,10.41 51.43,10.41 59.05,18.03 v1(59.05,19.94) ; v1(72.01,43.43) 76.45,47.88 SG90舵机上.2 SG90舵机下.2
  Bottom Layer w0.381: v1(72.01,43.43) 69.6,41.02 v1(69.6,31.5) ; v1(59.05,19.94) v1(59.05,24.13)
12V: length 19.7
  Top Layer w0.635: P6.1 P6.2 25.41,13.59 12V输入电源.1
GND: length 12.4
  Top Layer w0.305: v1(7.75,32.64) 7.01,33.38 TypeC.B1A12 ; v1(15.24,34.04) 16,34.8 CH340N.3
  Bottom Layer w0.305: v1(15.24,34.04) 13.39,32.18 8.2,32.18 v1(7.75,32.64)
V3: length 18.6
  Top Layer w0.254: 9.14,32.77 9.14,32.51 C1.1 ; v1(9.14,38.1) 12.72,41.67 CH340N.8
  Bottom Layer w0.254: v1(9.14,38.1) v1(9.14,32.89)
VCC: length 49.7
  Top Layer w0.305: 10.41,33.4 17.02,33.4 19.18,35.56 v1(19.18,37.21) ; 10.41,33.4 12.7,31.12 12.7,25.43 C2.2 ; 10.41,33.4 9.64,34.18 TypeC.B4A9 ; TypeC.A4B9 9,38.98 11.05,41.02 11.05,43.56 11.94,44.45 16.64,44.45 17.27,43.81 CH340N.5 18.54,40.4 v1(18.54,40.39)
  Bottom Layer w0.305: v1(19.18,37.21) 19.18,39.75 v1(18.54,40.39)
CC1: length 11.1
  Top Layer w0.254: R2.1 5.57,44.05 3.94,42.42 3.94,38.23 4.34,37.83 TypeC.A5
CC2: length 12
  Top Layer w0.254: TypeC.B5 4.29,34.83 3.3,35.81 R1.1
PA6: length 46.7
  Top Layer w0.305: P2.10 41.91,52.2 80.01,52.2 SG90舵机上.1
PA7: length 54.4
  Top Layer w0.305: SG90舵机下.1 82.17,53.85 41.02,53.85 P2.9
PA9: length 20.3
  Top Layer w0.305: CH340N.7 14.73,41.02 17.78,37.97 24.51,37.97 27.43,35.05 P1.15
PA10: length 21.3
  Top Layer w0.305: CH340N.6 16,41.02 17.78,39.24 25.4,39.24 29.97,34.67 29.97,30.61
PB8: length 33.9
  Top Layer w0.305: P1.5 53.09,30.35 53.09,26.92 58.8,21.21 75.31,21.21 OLED.3
PB9: length 34.2
  Top Layer w0.305: OLED.4 76.58,22.48 59.69,22.48 55.37,26.8 P1.4
PB10: length 58.9
  Top Layer w0.305: P2.6 33.4,41.91 74.68,41.91 MPU6050.6
PB11: length 58.9
  Top Layer w0.305: 24.89,47.88 32.89,39.88 74.17,39.88 MPU6050.5
UD+: length 12.1
  Top Layer w0.254: TypeC.A6 5.08,36.83 4.83,36.58 4.83,36.2 5.19,35.83 TypeC.B6 7.48,35.83 8.38,34.92 12.08,34.92 CH340N.1
UD-: length 12.3
  Top Layer w0.254: 8.81,37.33 10.78,37.33 11.68,38.23 13.72,38.23 14.73,37.21 CH340N.2 ; 8.81,37.33 TypeC.B7 ; 8.81,37.33 7.81,36.33 TypeC.A7

## Copper pours and planes (outline as drawn; the poured copper is in the pictures)
GND on Top Layer: 0.45,56.58 92.39,56.58 92.39,0.45 0.45,0.45

## Text on the board
Top Silkscreen Layer: STM32F103C8T6 | IN+ | IN- | Stlink | 降压模块 | 数据线 | GND | 5V
